# EAGLE design lightsensor-dip (EAGLE 5.10)
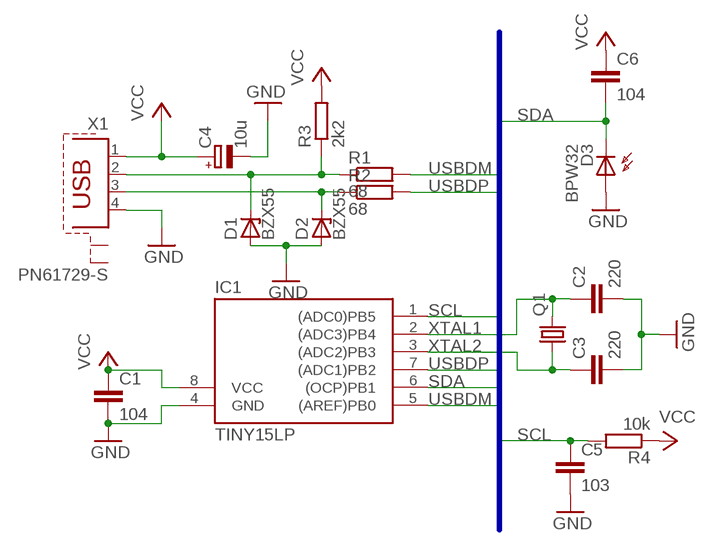
[diagram p0: schematic, sheet 1]

## Parts
C1  104  C-EU050-024X044  [C050-024X044]
C2  220  C-EU050-024X044  [C050-024X044]
C3  220  C-EU050-024X044  [C050-024X044]
C4  10u  CPOL-EUE2-4  [E2-4]
C5  103  C-EU050-024X044  [C050-024X044]
C6  104  C-EU050-024X044  [C050-024X044]
D1  BZX55  [DO35Z10]
D2  BZX55  [DO35Z10]
D3  BPW32  [BPW32]
IC1  TINY15LP  [DIL08]
Q1  CRYSTALHC49U-V  [HC49U-V]
R1  68  R-EU_0309/10  [0309/10]
R2  68  R-EU_0309/10  [0309/10]
R3  2k2  R-EU_0309/V  [0309V]
R4  10k  R-EU_0309/10  [0309/10]
X1  PN61729-S  [PN61729-S]

## Nets
GND: C1.2 C2.2 C3.2 C4.- C5.2 D1.A D2.A D3.A IC1.4(GND) X1.4
N$1: D1.C R1.1 R3.1 X1.2
N$2: D2.C R2.1 X1.3
SCL: C5.1 IC1.1((ADC0)PB5) R4.2
SDA: C6.2 D3.K(C) IC1.6((OCP)PB1)
USBDM: IC1.5((AREF)PB0) R1.2
USBDP: IC1.7((ADC1)PB2) R2.2
VCC: C1.1 C4.+ C6.1 IC1.8(VCC) R3.2 R4.1 X1.1
XTAL1: C2.1 IC1.2((ADC3)PB4) Q1.2
XTAL2: C3.1 IC1.3((ADC2)PB3) Q1.1
Unconnected: X1.S1 X1.S2

## Buses
USBDM,USBDP,SCL,SDA

## Library data of the parts
C1-C3 C5 C6 = rcl:C-EU: CAPACITOR, European symbol
C4 = rcl:CPOL-EU: POLARIZED CAPACITOR, European symbol
D1 D2 = diode:BZX55: Z DIODE
D3 = opto-trans-siemens:BPW32: PHOTO DIODE
IC1 = atmel:TINY15L: MICROCONTROLLER 2.7 V 1 Kbytes FLASH 64 bytes EEPROM 4-channel 10 bit ADC
Q1 = crystal:CRYSTAL: CRYSTAL
R1-R4 = rcl:R-EU_: RESISTOR, European symbol
X1 = con-berg:PN61729-S: BERG USB connector

## Board
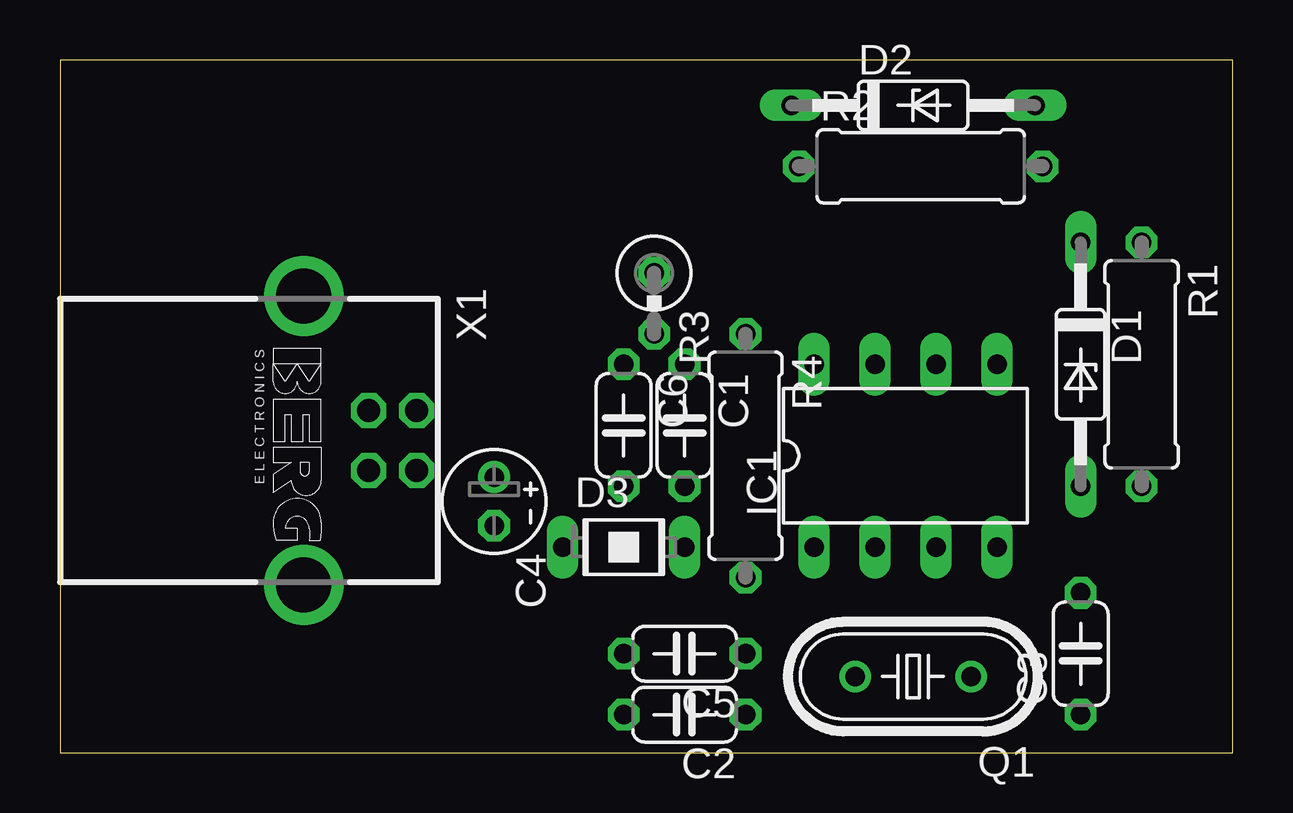
[diagram p1: board, top side]
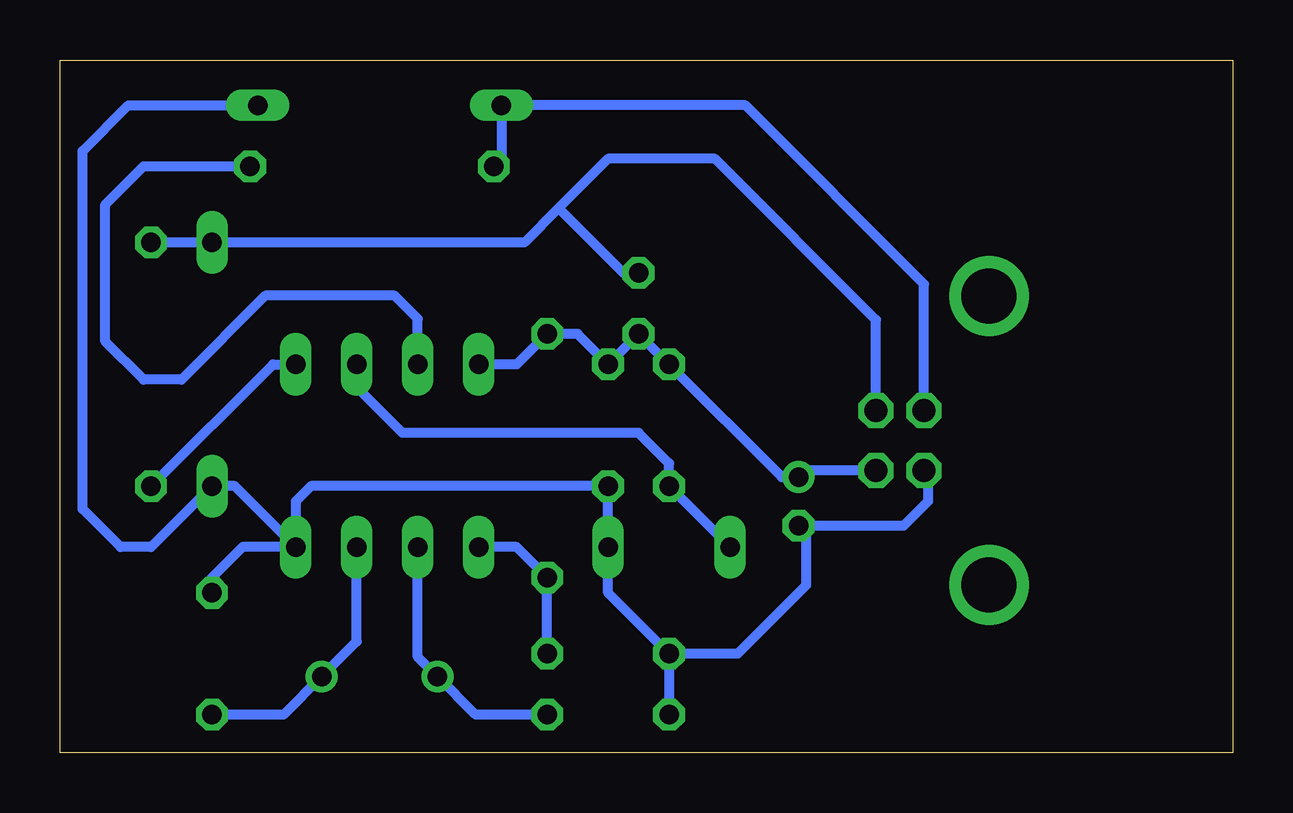
[diagram p2: board, bottom side, seen from below]

Size 48.88 x 28.88 mm. Coordinates in mm from the lower left corner, seen from the top.
Outline: 0,0 48.88,0 48.88,28.88 0,28.88 0,0
Copper layers (1*16): Top 0.035mm / dielectric 1.5mm / Bottom 0.035mm
Design rules "default": minimum track width 10mil, minimum drill 24mil, track to track 8mil, track to pad 8mil, pad to pad 8mil, via to via 8mil, smd to smd 8mil, copper to edge 40mil, drill to drill 8mil, minimum pad ring 10mil, minimum via ring 8mil, stop-mask expansion 4mil, vias tented up to drill 0mil, thermal gap 10mil

### Footprints (pad centres in the part's own frame; a part is rotated, then mirrored left to right if it is on the bottom)
C050-024X044 = drill 0.813 octagon: 1 -2.54,0; 2 2.54,0
E2-4 = drill 0.813 pad 1.27 round: + -1.016,0 | drill 0.813 pad 1.27 octagon: - 1.016,0
DO35Z10 = drill 0.813 long: A 5.08,0; C -5.08,0
BPW32 = drill 0.813 long: A 0,2.54; K 0,-2.54
DIL08 = drill 0.813 long: 1 -3.81,-3.81; 2 -1.27,-3.81; 3 1.27,-3.81; 4 3.81,-3.81; 5 3.81,3.81; 6 1.27,3.81; 7 -1.27,3.81; 8 -3.81,3.81
HC49U-V = drill 0.813 round: 1 -2.413,0; 2 2.413,0
0309/10 = drill 0.813 octagon: 1 -5.08,0; 2 5.08,0
0309V = drill 0.813 octagon: 1 -1.27,0; 2 1.27,0
PN61729-S = drill 0.95 octagon: 1 1.25,4.71; 2 -1.25,4.71; 3 -1.25,2.71; 4 1.25,2.71 | drill 2.3 pad 2.9 round: S1 -6.02,0; S2 6.02,0

### Placement (x,y rotation side)
C1  26.04,13.65 270 top
C2  26.04,1.59 180 top
C3  42.55,4.13 90 top
C4  18.1,10.48 270 top
C5  26.04,4.13 180 top
C6  23.5,13.65 270 top
D1  42.55,16.19 270 top
D2  35.56,26.99 0 top
D3  23.5,8.57 270 top
IC1  35.24,12.38 0 top
Q1  35.56,3.17 180 top
R1  45.09,16.19 270 top
R2  35.88,24.45 0 top
R3  24.77,18.73 270 top
R4  28.57,12.38 270 top
X1  10.16,13.02 270 top

### Tracks (layer width: path | path; a pad name or v marks a point on that pad's centre or on a via)
GND
  Bottom 0.406: C3.2 42.55,7.3 41.27,8.57 IC1.4 | IC1.4 39.05,10.48 38.42,11.11 C1.2 D3.A 26.04,6.67 C5.2 | C5.2 C2.2 | D2.A 46.04,26.99 47.94,25.08 47.94,10.16 46.35,8.57 45.09,8.57 D1.A 41.59,11.11 IC1.4 | X1.4 12.7,11.6 12.7,10.48 13.72,9.46 C4.- 17.78,9.14 17.78,6.99 20.64,4.13 C5.2
N$1
  Bottom 0.406: X1.2 14.87,18.05 21.59,24.77 26.04,24.77 28.1,22.7 | R1.1 D1.C 29.53,21.27 28.1,22.7 | R3.1 25.4,20 28.1,22.7
N$2
  Bottom 0.406: X1.3 12.87,19.54 20.32,26.99 D2.C 30.48,24.77 R2.1
SCL
  Bottom 0.406: IC1.1 29.84,8.57 R4.2 C5.1
SDA
  Bottom 0.406: D3.K C6.2 23.5,12.06 24.77,13.34 34.61,13.34 36.51,15.24 IC1.6
USBDM
  Bottom 0.406: IC1.5 40.01,16.19 R1.2
USBDP
  Bottom 0.406: IC1.7 33.97,18.1 34.92,19.05 40.32,19.05 43.81,15.56 45.4,15.56 46.99,17.14 46.99,22.86 45.4,24.45 R2.2
VCC
  Bottom 0.406: IC1.8 29.84,16.19 R4.1 27.3,17.46 C1.1 R3.2 C6.1 18.8,11.49 C4.+ 17.82,11.77 X1.1
XTAL1
  Bottom 0.406: IC1.2 33.97,4 Q1.2 31.56,1.59 C2.1
XTAL2
  Bottom 0.406: IC1.3 36.51,4.64 Q1.1 39.56,1.59 C3.1